# EasyEDA schematic speeduino PCB for M50nv M50TU SIEMENS MS40.1.json
TITLE: Speeduino compatible ms41 PCB for M52; REV: 2.0; Date: 1.1.2020; Sheet: 1/1; Drawn By: pazi88
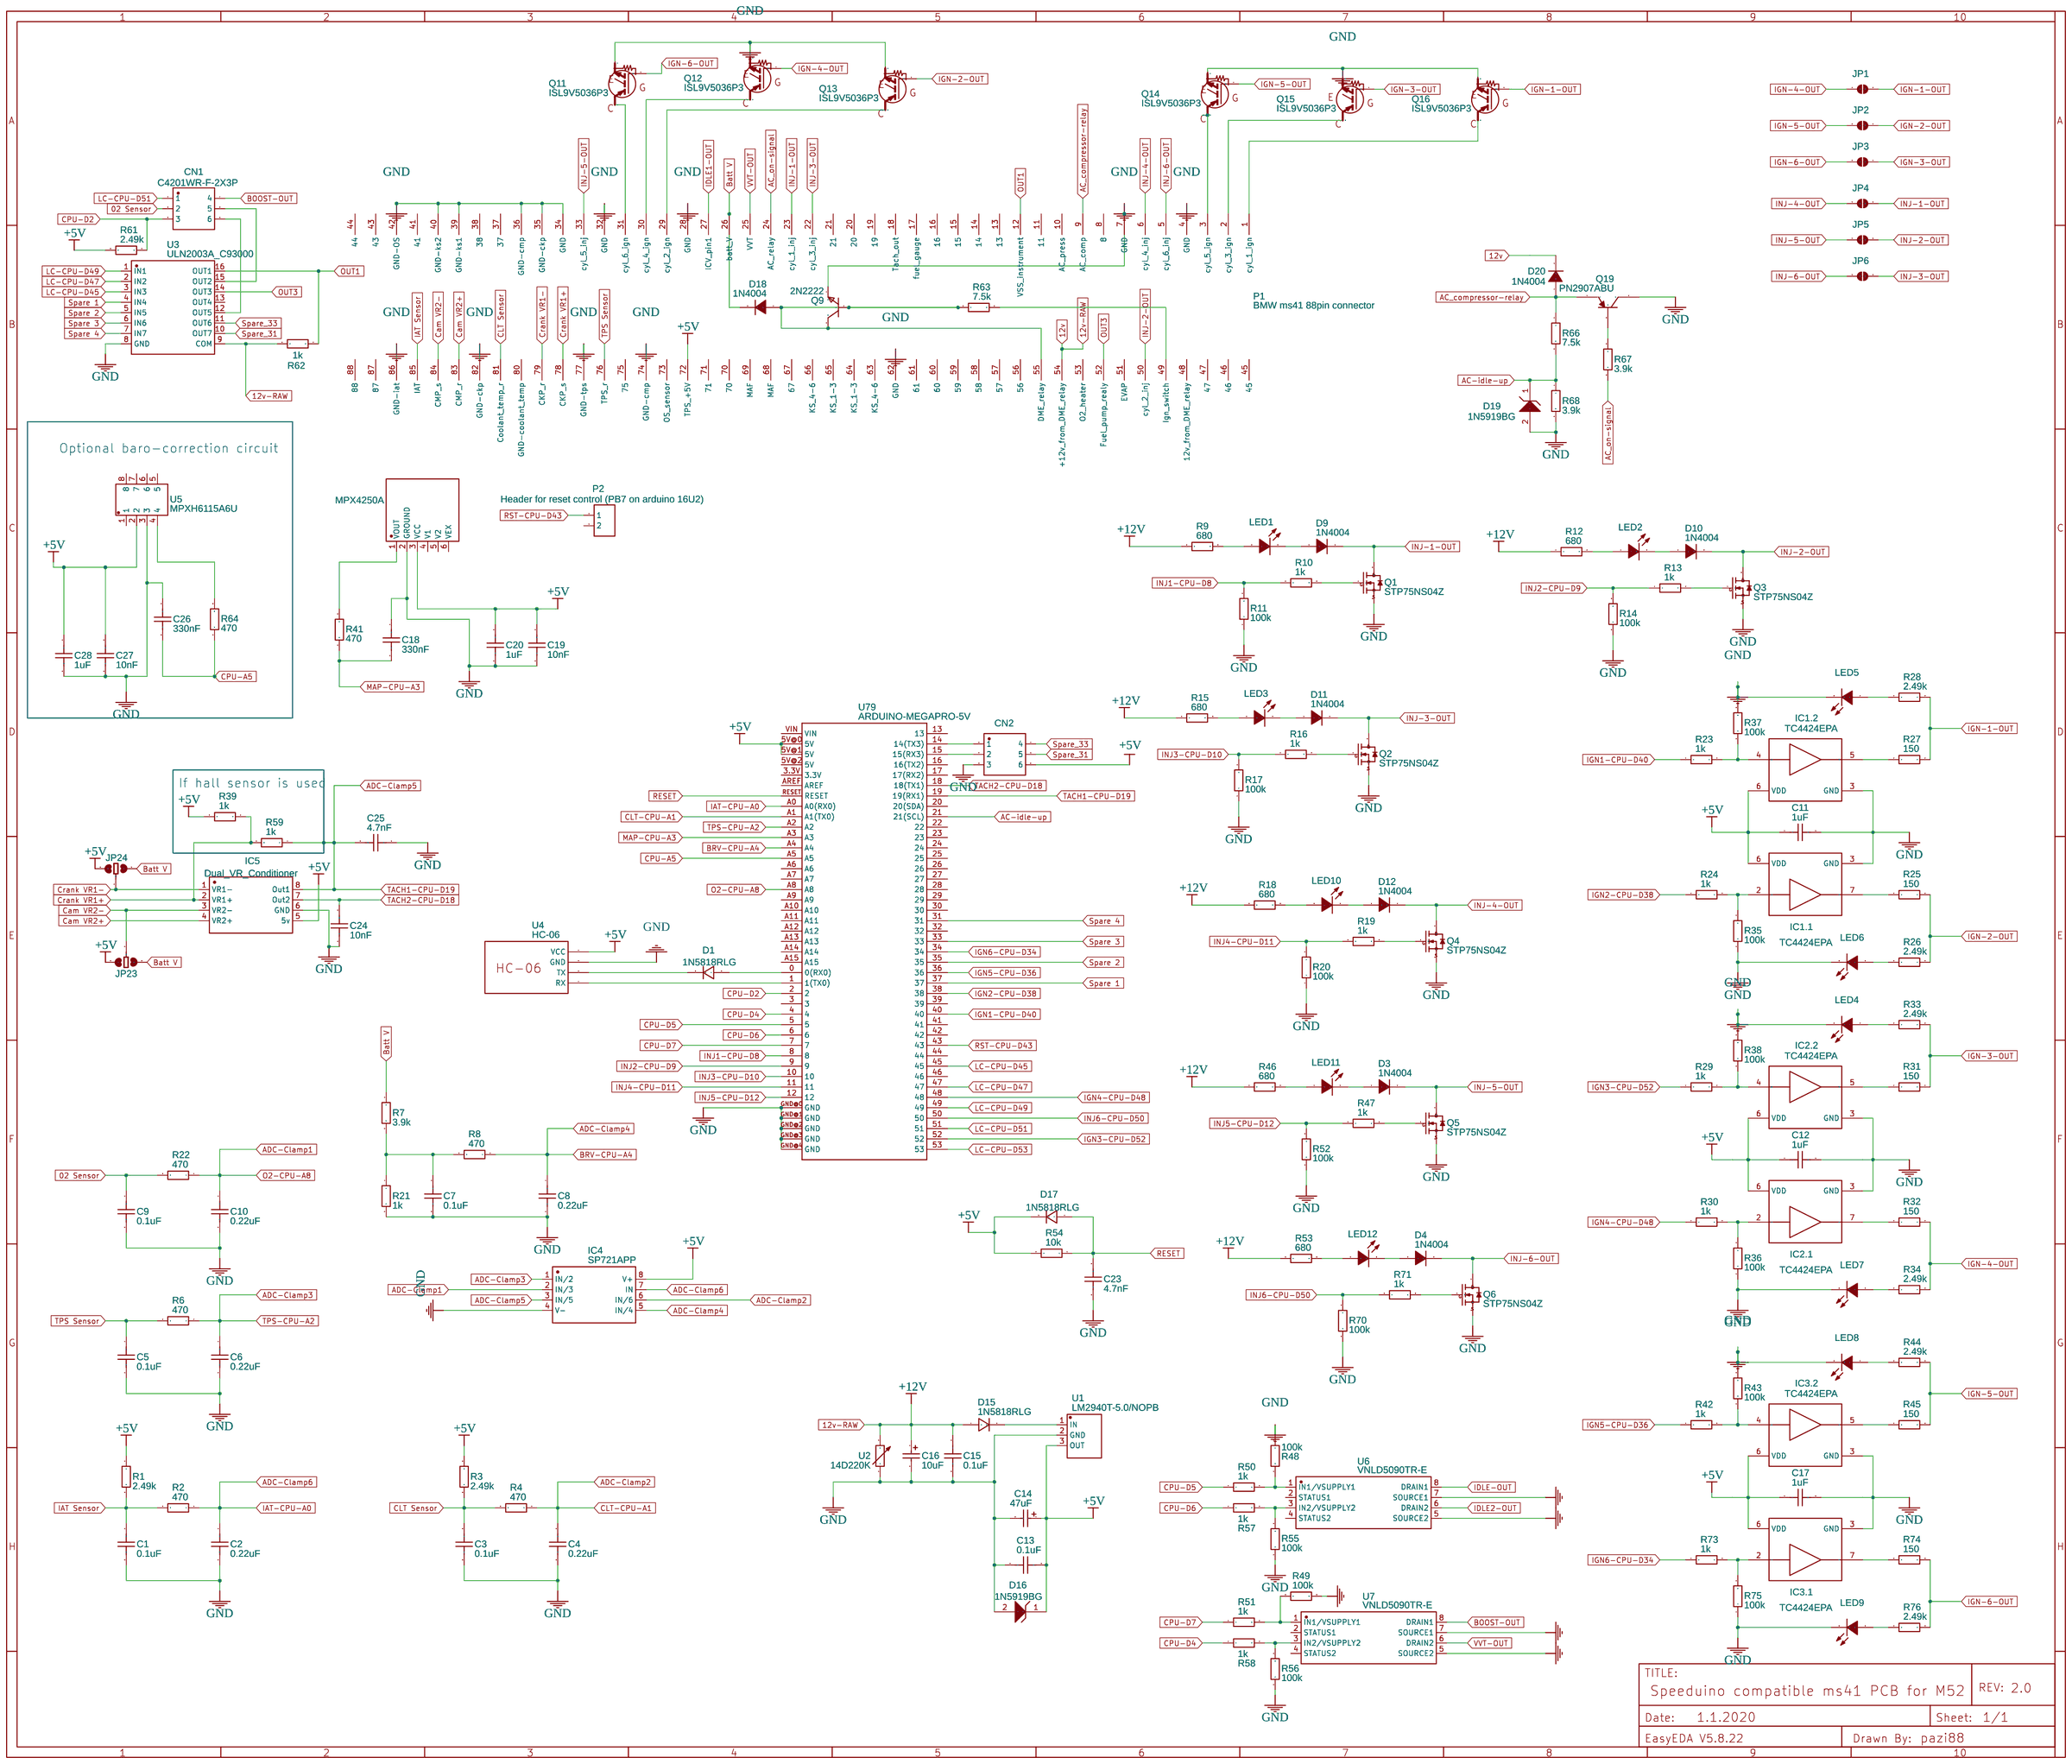
[diagram p0: schematic sheet]

## Parts
C1  0.1uF  [CAP-0.2]
C2  0.22uF  [CAP-0.2]
C3  0.1uF  [CAP-0.2]
C4  0.22uF  [CAP-0.2]
C5  0.1uF  [CAP-0.2]
C6  0.22uF  [CAP-0.2]
C7  0.1uF  [CAP-0.2]
C8  0.22uF  [CAP-0.2]
C9  0.1uF  [CAP-0.2]
C10  0.22uF  [CAP-0.2]
C11  1uF  [CAP-0.2]
C12  1uF  [CAP-0.2]
C13  0.1uF  [CAP-0.2]
C14  47uF  [CAP-TAN-S2.5]
C15  0.1uF  [CAP-0.2]
C16  10uF  [CAP-TAN-S2.5]
C17  1uF  [CAP-0.2]
C18  330nF  [CAP-0.2]
C19  10nF  [CAP-0.2]
C20  1uF  [CAP-0.2]
C23  4.7nF  [CAP-0.2]
C24  10nF  [CAP-0.2]
C25  4.7nF  [CAP-0.2]
C26  330nF  [CAP-0.2]
C27  10nF  [CAP-0.2]
C28  1uF  [CAP-0.2]
CN1  C4201WR-F-2X3P  [C4201WR-F-2X3P]
CN2  C4201WR-F-2X3P  [C4201WR-F-2X3P]
D1  1N5818RLG  [DO-41]
D3  1N4004  [DO-41]
D4  1N4004  [DO-41]
D9  1N4004  [DO-41]
D10  1N4004  [DO-41]
D11  1N4004  [DO-41]
D12  1N4004  [DO-41]
D15  1N5818RLG  [DO-41]
D16  1N5919BG  [DO-41 ZENER]
D17  1N5818RLG  [DO-41]
D18  1N4004  [DO-41]
D19  1N5919BG  [DO-41 ZENER]
D20  1N4004  [DO-41]
IC1  TC4424EPA  [DIP-8]  (sections 1,2)
IC2  TC4424EPA  [DIP-8]  (sections 1,2)
IC3  TC4424EPA  [DIP-8]  (sections 1,2)
IC4  SP721APP  [DIP8-2.54-10.9X6.6MM]
IC5  Dual_VR_Conditioner  [SPEEDUINO VR-CONDITIONER]
JP1  Solder Jumper  [SOLDER_JUMPER_2_PADS_MEDIUM-WIDE]
JP2  Solder Jumper  [SOLDER_JUMPER_2_PADS_MEDIUM-WIDE]
JP3  Solder Jumper  [SOLDER_JUMPER_2_PADS_MEDIUM-WIDE]
JP4  Solder Jumper  [SOLDER_JUMPER_2_PADS_MEDIUM-WIDE]
JP5  Solder Jumper  [SOLDER_JUMPER_2_PADS_MEDIUM-WIDE]
JP6  Solder Jumper  [SOLDER_JUMPER_2_PADS_MEDIUM-WIDE]
JP23  JP4  [WIDE_SOLDER_JUMPER_3_PAD]
JP24  JP4  [WIDE_SOLDER_JUMPER_3_PAD]
LED1  LED  [LED-3MM]
LED2  LED  [LED-3MM]
LED3  LED  [LED-3MM]
LED4  LED  [LED-3MM]
LED5  LED  [LED-3MM]
LED6  LED  [LED-3MM]
LED7  LED  [LED-3MM]
LED8  LED  [LED-3MM]
LED9  LED  [LED-3MM]
LED10  LED  [LED-3MM]
LED11  LED  [LED-3MM]
LED12  LED  [LED-3MM]
P1  BMW ms41 88pin connector  [MS41 88PIN]
P2  Header for reset control (PB7 on arduino 16U2)  [HDR-1X2/2.54]
Q1  STP75NS04Z  [TO-220(TO-220-3)]
Q2  STP75NS04Z  [TO-220(TO-220-3)]
Q3  STP75NS04Z  [TO-220(TO-220-3)]
Q4  STP75NS04Z  [TO-220(TO-220-3)]
Q5  STP75NS04Z  [TO-220(TO-220-3)]
Q6  STP75NS04Z  [TO-220(TO-220-3)]
Q9  2N2222  [TO-92(TO-92-3) WIDER]
Q11  ISL9V5036P3  [TO-220(TO-220-3)]
Q12  ISL9V5036P3  [TO-220(TO-220-3)]
Q13  ISL9V5036P3  [TO-220(TO-220-3)]
Q14  ISL9V5036P3  [TO-220(TO-220-3)]
Q15  ISL9V5036P3  [TO-220(TO-220-3)]
Q16  ISL9V5036P3  [TO-220(TO-220-3)]
Q19  PN2907ABU  [TO-92(TO-92-3) WIDER]
R1  2.49k  [AXIAL-0.3]
R2  470  [AXIAL-0.3]
R3  2.49k  [AXIAL-0.3]
R4  470  [AXIAL-0.3]
R6  470  [AXIAL-0.3]
R7  3.9k  [AXIAL-0.3]
R8  470  [AXIAL-0.3]
R9  680  [AXIAL-0.3]
R10  1k  [AXIAL-0.3]
R11  100k  [AXIAL-0.3]
R12  680  [AXIAL-0.3]
R13  1k  [AXIAL-0.3]
R14  100k  [AXIAL-0.3]
R15  680  [AXIAL-0.3]
R16  1k  [AXIAL-0.3]
R17  100k  [AXIAL-0.3]
R18  680  [AXIAL-0.3]
R19  1k  [AXIAL-0.3]
R20  100k  [AXIAL-0.3]
R21  1k  [AXIAL-0.3]
R22  470  [AXIAL-0.3]
R23  1k  [AXIAL-0.3]
R24  1k  [AXIAL-0.3]
R25  150  [AXIAL-7.1X2.3(1/2W)]
R26  2.49k  [AXIAL-0.3]
R27  150  [AXIAL-7.1X2.3(1/2W)]
R28  2.49k  [AXIAL-0.3]
R29  1k  [AXIAL-0.3]
R30  1k  [AXIAL-0.3]
R31  150  [AXIAL-7.1X2.3(1/2W)]
R32  150  [AXIAL-7.1X2.3(1/2W)]
R33  2.49k  [AXIAL-0.3]
R34  2.49k  [AXIAL-0.3]
R35  100k  [AXIAL-0.3]
R36  100k  [AXIAL-0.3]
R37  100k  [AXIAL-0.3]
R38  100k  [AXIAL-0.3]
R39  1k  [AXIAL-0.3]
R41  470  [AXIAL-0.3]
R42  1k  [AXIAL-0.3]
R43  100k  [AXIAL-0.3]
R44  2.49k  [AXIAL-0.3]
R45  150  [AXIAL-7.1X2.3(1/2W)]
R46  680  [AXIAL-0.3]
R47  1k  [AXIAL-0.3]
R48  100k  [AXIAL-0.3]
R49  100k  [AXIAL-0.3]
R50  1k  [AXIAL-0.3]
R51  1k  [AXIAL-0.3]
R52  100k  [AXIAL-0.3]
R53  680  [AXIAL-0.3]
R54  10k  [AXIAL-0.3]
R55  100k  [AXIAL-0.3]
R56  100k  [AXIAL-0.3]
R57  1k  [AXIAL-0.3]
R58  1k  [AXIAL-0.3]
R59  1k  [AXIAL-0.3]
R61  2.49k  [AXIAL-0.3]
R62  1k  [AXIAL-0.3]
R63  7.5k  [AXIAL-0.3]
R64  470  [AXIAL-0.3]
R66  7.5k  [AXIAL-0.3]
R67  3.9k  [AXIAL-0.3]
R68  3.9k  [AXIAL-0.3]
R70  100k  [AXIAL-0.3]
R71  1k  [AXIAL-0.3]
R73  1k  [AXIAL-0.3]
R74  150  [AXIAL-7.1X2.3(1/2W)]
R75  100k  [AXIAL-0.3]
R76  2.49k  [AXIAL-0.3]
U1  LM2940T-5.0/NOPB  [TO-220(TO-220-3)]
U2  14D220K  [PS-RES-16.5*7.51]
U3  ULN2003A_C93000  [DIP-16]
U4  HC-06  [BLUETOOTH HC-06]
U5  MPXH6115A6U  [SSOP-8_MPXH]
U6  VNLD5090TR-E  [SO-8_WITH_NOTCH]
U7  VNLD5090TR-E  [SO-8_WITH_NOTCH]
U78  MPX4250A  [MPX4250AP_WITH_HOLES_AND_SILK_SCREEN]
U79  ARDUINO-MEGAPRO-5V  [ARDUINO_MEGA-PRO EDITED]

## Library data of the parts
C1-C13 C15 C17-C20 C23-C28 = CT4-0805B103K500F3: Supplier: LCSC; Manufacturer: FH; Contributor: LCSC; Supplier Part: C94713
C14 = TAP476K016SCS: Supplier: LCSC; Manufacturer: AVX; Supplier Part: C56699
C16 = TAP106K035SCS: Supplier: LCSC; Manufacturer: AVX; Supplier Part: C73787
CN1 CN2 = -: Supplier: LCSC; Supplier Part: C239505; Manufacturer: Changjiang Connectors; Manufacturer Part: C4201WR-F-2x3P; Contributor: LCSC; link: https://item.szlcsc.com/238609.html?ref=editor&logined=true
D1 D15 D17 = -: Supplier Part: C152526; Supplier: LCSC; Manufacturer: ON; Contributor: LCSC
D3 D4 D9-D12 D18 D20 = -: Supplier: LCSC; Manufacturer: LRC; Supplier Part: C83357
D16 D19 = -: 3 W Zener Voltage Regulator, 2-Pin Axial_Lead, Pb-Free, Bulk Box; Manufacturer Part: ?
IC1-IC3 = -: tags: MOSFET Driver; Supplier Part: C52285; Supplier: LCSC; Manufacturer: MICROCHIP; subpart_no: 1
IC4 = -: Contributor: pazi88; Supplier: Mouser; Supplier Part: 576-SP721APP; Manufacturer: Littelfuse
IC5 = -: Contributor: pazi88; Manufacturer Part: ?
JP1-JP6 = -: Contributor: SparkFun; sourceId: u4NHBvNHB; Manufacturer Part: ?
JP23 JP24 = -: Manufacturer Part: ?; Contributor: nostaticatall
LED1-LED12 = -: Supplier: LCSC; Manufacturer: Lite-On; Manufacturer Part: LTL-4221N; image: //image.lceda.cn/szlcsc/C62095.jpg; Supplier Part: C125081
P1 = -: Manufacturer Part: ?; Contributor: pazi88
P2 = -: Supplier: LCSC; Manufacturer: BOOMELE; Manufacturer Part: 2.54-1*2PFemale; image: //image.lceda.cn/szlcsc/C49661.jpg; Supplier Part: C49661
Q1-Q6 = -: Supplier: Mouser; Manufacturer: STMicroelectronics; Contributor: LCSC; Supplier Part: 511-STP75NS04Z
Q9 = -: Supplier: LCSC; Manufacturer: SEMTECH; Contributor: LCSC; Supplier Part: C118536
Q11-Q16 = -: Manufacturer part: ON Semiconductor / Fairchild; Link: https://eu.mouser.com/datasheet/2/308/ISL9V5036P_F085-1120623.pdf; Manufacturer Part: ISL9V5036P3-F085; Supplier: Mouser; Supplier Part: 512-ISL9V5036P3-F085; link: https://eu.mouser.com/datasheet/2/308/ISL9V5036P_F085-1120623.pdf; Contributor: pazi88
Q19 = -: Supplier: LCSC; Manufacturer: FAIRCHILD; Contributor: LCSC; Supplier Part: C14215; Package Display: No
R1-R4 R6-R24 R26 R28-R30 R33-R39 R41-R44 R46-R59 R61 R62 R64 R67 R68 R70 R71 R73 R75 R76 = Res_AXIAL-0.3(1/8W)_EU: Manufacturer Part: ?
R25 R27 R31 R32 R45 R74 = MFR2WSJT-73-150R: Supplier: LCSC; Supplier Part: undefined; Contributor: LCSC
R63 R66 = Res_AXIAL-0.3(1/8W)_EU: Manufacturer Part: MFR0W4F7501A50; Supplier: LCSC; Supplier Part: C58628; Manufacturer: Uniroyal Elec
U1 = -: Supplier: LCSC; Manufacturer: Texas Instruments; Supplier Part: C308879
U2 = 14D220K: Supplier: LCSC; Manufacturer: HEL; Supplier Part: C136782
U3 = -: Supplier: LCSC; Supplier Part: C93000; Manufacturer: STMicroelectronics; Manufacturer Part: ULN2003A; Contributor: LCSC
U4 = -: Contributor: nico.hampl1999; sourceId: 31jdvN5mE; Manufacturer Part: ?
U5 = -: Supplier: Mouser; Supplier Part: 841-MPXH6115A6U; Manufacturer: Freescale Semicon; Contributor: pazi88; link: https://www.mouser.fi/datasheet/2/302/MPXA6115A-1127121.pdf
U6 U7 = -: Supplier: LCSC; Supplier Part: C222209; Manufacturer: STMicroelectronics; Contributor: LCSC
U78 = -: Supplier: Mouser; Manufacturer: NXP; Manufacturer Part: MPX4250AP; Contributor: LCSC; Supplier Part: 841-MPX4250AP
U79 = -: Arduino Mega board footprint; Contributor: SparkFun; Manufacturer Part: ?

## Nets
+5V: C11.1 C12.1 C13.2 C14.1 C17.1 C19.1 C20.1 C27.1 C28.1 CN2.6 D16.1(K) D17.2 IC1.6(VDD) IC2.6(VDD) IC3.6(VDD) IC4.8(V+) IC5.5(5v) JP23.1 JP24.3 P1.72(TPS +5V) R1.1 R3.1 R39.2 R54.2 R61.2 U1.3(OUT) U4.1(VCC) U5.2 U78.3(VCC) U79.5V@0(5V) U79.5V@1(5V)
+12V: C15.1 C16.1 D15.1 D20.2(K) P1.54(+12v from DME relay) R9.1 R12.1 R15.1 R18.1 R46.1 R53.1 R62.2 U2.2 U3.9(COM)
GND: C1.2 C2.2 C3.2 C4.2 C5.2 C6.2 C7.2 C8.2 C9.2 C10.2 C11.2 C12.2 C13.1 C14.2 C15.2 C16.2 C17.2 C18.1 C19.2 C20.2 C23.1 C24.1 C25.1 C26.1 C27.2 C28.2 CN2.3 D16.2(A) D19.2(A) IC1.3(GND) IC2.3(GND) IC3.3(GND) IC4.4(V-) IC5.6(GND) LED4.2(K) LED5.2(K) LED6.2(K) LED7.2(K) LED8.2(K) LED9.2(K) P1.4(GND) P1.7(GND) P1.28(GND) P1.32(GND) P1.34(GND) P1.35(GND-ckp) P1.36(GND-cmp) P1.39(GND-ks1) P1.40(GND-ks2) P1.42(GND-OS) P1.62(GND) P1.74(GND-cmp) P1.77(GND-tps) P1.82(GND-ckp) P1.86(GND-iat) Q1.3(S) Q2.3(S) Q3.3(S) Q4.3(S) Q5.3(S) Q6.3(S) Q9.1(E) Q11.3(E) Q12.3(E) Q13.3(E) Q14.3(E) Q15.3(E) Q16.3(E) Q19.3(C) R11.1 R14.1 R17.1 R20.1 R21.2 R35.1 R36.1 R37.2 R38.2 R43.2 R48.1 R49.1 R52.1 R55.1 R56.1 R68.2 R70.1 R75.1 U1.2(GND) U2.1 U3.8(GND) U4.2(GND) U5.3 U6.5(SOURCE2) U6.7(SOURCE1) U7.5(SOURCE2) U7.7(SOURCE1) U78.2(GROUND) U79.GND@0(GND) U79.GND@1(GND) U79.GND@2(GND) U79.GND@3(GND) U79.GND@4(GND)
02 Sensor: C9.1 CN1.2 R22.2
AC-idle-up: D19.1(K) R66.2 R68.1 U79.21(21(SCL))
AC_compressor-relay: D20.1(A) P1.9(AC_comp) Q19.1(E) R66.1
AC_on-signal: P1.24(AC_relay) R67.2
ADC-Clamp1: C10.1 IC4.2(IN/3) R22.1 U79.A8
ADC-Clamp2: C4.1 IC4.6(IN/6) R4.1 U79.A1(A1(TX0))
ADC-Clamp3: C6.1 IC4.1(IN/2) R6.1 U79.A2
ADC-Clamp4: C8.1 IC4.5(IN/4) R8.1 U79.A4
ADC-Clamp5: C25.2 IC4.3(IN/5) IC5.8(Out1) R59.1 U79.19(19(RX1))
ADC-Clamp6: C2.1 IC4.7(IN) R2.1 U79.A0(A0(RX0))
Batt V: D18.2(K) JP23.3 JP24.1 P1.26(batt V) R7.1
BOOST-OUT: CN1.4 U7.8(DRAIN1)
Cam VR2+: IC5.4(VR2+) P1.83(CMP r)
Cam VR2-: IC5.3(VR2-) JP23.2 P1.84(CMP s)
CLT Sensor: C3.1 P1.81(Coolant temp r) R3.2 R4.2
CPU-A5: C26.2 R64.1 U79.A5
CPU-D2: CN1.3 R61.1 U79.2
CPU-D4: R58.1 U79.4
CPU-D5: R50.1 U79.5
CPU-D6: R57.1 U79.6
CPU-D7: R51.1 U79.7
Crank VR1+: IC5.2(VR1+) P1.78(CKP s) R39.1 R59.2
Crank VR1-: IC5.1(VR1-) JP24.2 P1.79(CKP r)
IAT Sensor: C1.1 P1.85(IAT) R1.2 R2.2
IDLE1-OUT: P1.27(ICV pin1)
IDLE2-OUT: U6.6(DRAIN2)
IDLE-OUT: U6.8(DRAIN1)
IGN1-CPU-D40: R23.1 U79.40
IGN2-CPU-D38: R24.1 U79.38
IGN3-CPU-D52: R29.1 U79.52
IGN4-CPU-D48: R30.1 U79.48
IGN5-CPU-D36: R42.1 U79.36
IGN6-CPU-D34: R73.1 U79.34
IGN-1-OUT: JP1.1 Q16.1(G) R27.2 R28.2
IGN-2-OUT: JP2.1 Q13.1(G) R25.2 R26.2
IGN-3-OUT: JP3.1 Q15.1(G) R31.2 R33.2
IGN-4-OUT: JP1.2 Q12.1(G) R32.2 R34.2
IGN-5-OUT: JP2.2 Q14.1(G) R44.2 R45.2
IGN-6-OUT: JP3.2 Q11.1(G) R74.2 R76.2
INJ1-CPU-D8: R10.1 R11.2 U79.8
INJ2-CPU-D9: R13.1 R14.2 U79.9
INJ3-CPU-D10: R16.1 R17.2 U79.10
INJ4-CPU-D11: R19.1 R20.2 U79.11
INJ5-CPU-D12: R47.1 R52.2 U79.12
INJ6-CPU-D50: R70.2 R71.1 U79.50
INJ-1-OUT: D9.2(K) JP4.1 P1.23(cyl 1 inj) Q1.2(D)
INJ-2-OUT: D10.2(K) JP5.1 P1.50(cyl 2 inj) Q3.2(D)
INJ-3-OUT: D11.2(K) JP6.1 P1.22(cyl 3 inj) Q2.2(D)
INJ-4-OUT: D12.2(K) JP4.2 P1.6(cyl 4 inj) Q4.2(D)
INJ-5-OUT: D3.2(K) JP5.2 P1.33(cyl 5 inj) Q5.2(D)
INJ-6-OUT: D4.2(K) JP6.2 P1.5(cyl 6 inj) Q6.2(D)
LC-CPU-D45: U3.3(IN3) U79.45
LC-CPU-D47: U3.2(IN2) U79.47
LC-CPU-D49: U3.1(IN1) U79.49
LC-CPU-D51: CN1.1 U79.51
LC-CPU-D53: U79.53
MAP-CPU-A3: C18.2 R41.1 U79.A3
OUT1: P1.12(VSS_instrument) R62.1 U3.16(OUT1)
OUT3: P1.52(Fuel pump realy) U3.14(OUT3)
RESET: C23.2 D17.1 R54.1 U79.RESET
RST-CPU-D43: P2.1 U79.43
Spare 1: U3.4(IN4) U79.37
Spare 2: U3.5(IN5) U79.35
Spare 3: U3.6(IN6) U79.33
Spare 4: U3.7(IN7) U79.31
Spare_31: CN2.5 U3.10(OUT7)
Spare_33: CN2.4 U3.11(OUT6)
TACH2-CPU-D18: C24.2 IC5.7(Out2) U79.18(18(TX1))
TPS Sensor: C5.1 P1.76(TPS r) R6.2
VVT-OUT: P1.25(VVT) U7.6(DRAIN2)
Net-(C7-1): C7.1 R7.2 R8.2 R21.1
Net-(CN1-5): CN1.5 U3.15(OUT2)
Net-(CN1-6): CN1.6 U3.12(OUT5)
Net-(CN2-1): CN2.1 U79.14(14(TX3))
Net-(CN2-2): CN2.2 U79.15(15(RX3))
Net-(D1-1): D1.1 U79.0(0(RX0))
Net-(D1-2): D1.2 U4.3(TX)
Net-(D3-1): D3.1(A) LED11.2(K)
Net-(D4-1): D4.1(A) LED12.2(K)
Net-(D9-1): D9.1(A) LED1.2(K)
Net-(D10-1): D10.1(A) LED2.2(K)
Net-(D11-1): D11.1(A) LED3.2(K)
Net-(D12-1): D12.1(A) LED10.2(K)
Net-(D15-2): D15.2 U1.1(IN)
Net-(D18-1): D18.1(A) P1.55(DME relay) Q9.2(B) Q9.3(C) R63.2
Net-(IC1.1-2): IC1.2(INA) R24.2 R35.2
Net-(IC1.1-7): IC1.7(OUTA) R25.1
Net-(IC1.2-4): IC1.4(INB) R23.2 R37.1
Net-(IC1.2-5): IC1.5(OUTB) R27.1
Net-(IC2.1-2): IC2.2(INA) R30.2 R36.2
Net-(IC2.1-7): IC2.7(OUTA) R32.1
Net-(IC2.2-4): IC2.4(INB) R29.2 R38.1
Net-(IC2.2-5): IC2.5(OUTB) R31.1
Net-(IC3.1-2): IC3.2(INA) R73.2 R75.2
Net-(IC3.1-7): IC3.7(OUTA) R74.1
Net-(IC3.2-4): IC3.4(INB) R42.2 R43.1
Net-(IC3.2-5): IC3.5(OUTB) R45.1
Net-(LED1-1): LED1.1(A) R9.2
Net-(LED2-1): LED2.1(A) R12.2
Net-(LED3-1): LED3.1(A) R15.2
Net-(LED4-1): LED4.1(A) R33.1
Net-(LED5-1): LED5.1(A) R28.1
Net-(LED6-1): LED6.1(A) R26.1
Net-(LED7-1): LED7.1(A) R34.1
Net-(LED8-1): LED8.1(A) R44.1
Net-(LED9-1): LED9.1(A) R76.1
Net-(LED10-1): LED10.1(A) R18.2
Net-(LED11-1): LED11.1(A) R46.2
Net-(LED12-1): LED12.1(A) R53.2
Net-(P1-1): P1.1(cyl 1 ign) Q16.2(C)
Net-(P1-2): P1.2(cyl 3 ign) Q15.2(C)
Net-(P1-3): P1.3(cyl 5 ign) Q14.2(C)
Net-(P1-29): P1.29(cyl 2 ign) Q13.2(C)
Net-(P1-30): P1.30(cyl 4 ign) Q12.2(C)
Net-(P1-31): P1.31(cyl 6 ign) Q11.2(C)
Net-(P1-49): P1.49(Ign switch) R63.1
Net-(Q1-1): Q1.1(G) R10.2
Net-(Q2-1): Q2.1(G) R16.2
Net-(Q3-1): Q3.1(G) R13.2
Net-(Q4-1): Q4.1(G) R19.2
Net-(Q5-1): Q5.1(G) R47.2
Net-(Q6-1): Q6.1(G) R71.2
Net-(Q19-2): Q19.2(B) R67.1
Net-(R41-2): R41.2 U78.1(VOUT)
Net-(R48-2): R48.2 R50.2 U6.1(IN1/VSUPPLY1)
Net-(R49-2): R49.2 R51.2 U7.1(IN1/VSUPPLY1)
Net-(R55-2): R55.2 R57.2 U6.3(IN2/VSUPPLY2)
Net-(R56-2): R56.2 R58.2 U7.3(IN2/VSUPPLY2)
Net-(R64-2): R64.2 U5.4
Net-(U4-4): U4.4(RX) U79.1(1(TX0))

Not connected (* = marked no-connect by the designer): P1 8 10(AC_press) 11 13 14 15 16 17(fuel_gauge) 18(Tach out) 19 20 21 37 38 41 43 44 45 46 47 48(12v from DME relay) 51(EVAP) 53(O2 heater) 56 57 58 59 60 61 63(KS 4-6) 64(KS 1-3) 65(KS 1-3) 66(KS 4-6) 67 68(MAF) 69(MAF) 70 71 73(OS sensor) 75 80(GND-coolant temp) 87 88; P2 2; U3 13(OUT4); U5 1 5 6 7 8; U6 2(STATUS1) 4(STATUS2); U7 2(STATUS1) 4(STATUS2); U78 4(V1) 5(V2) 6(VEX); U79 3 3.3V 5V@2(5V) 13 16(16(TX2)) 17(17(RX2)) 20(20(SDA)) 22 23 24 25 26 27 28 29 30 32 39 41 42 44 46 A6 A7 A9 A10 A11 A12 A13 A14 A15 AREF VIN

## Notes on the sheet
- Optional baro-correction circuit
- If hall sensor is used
